# EAGLE design temperature-shift-r1 (EAGLE 6.5.0)
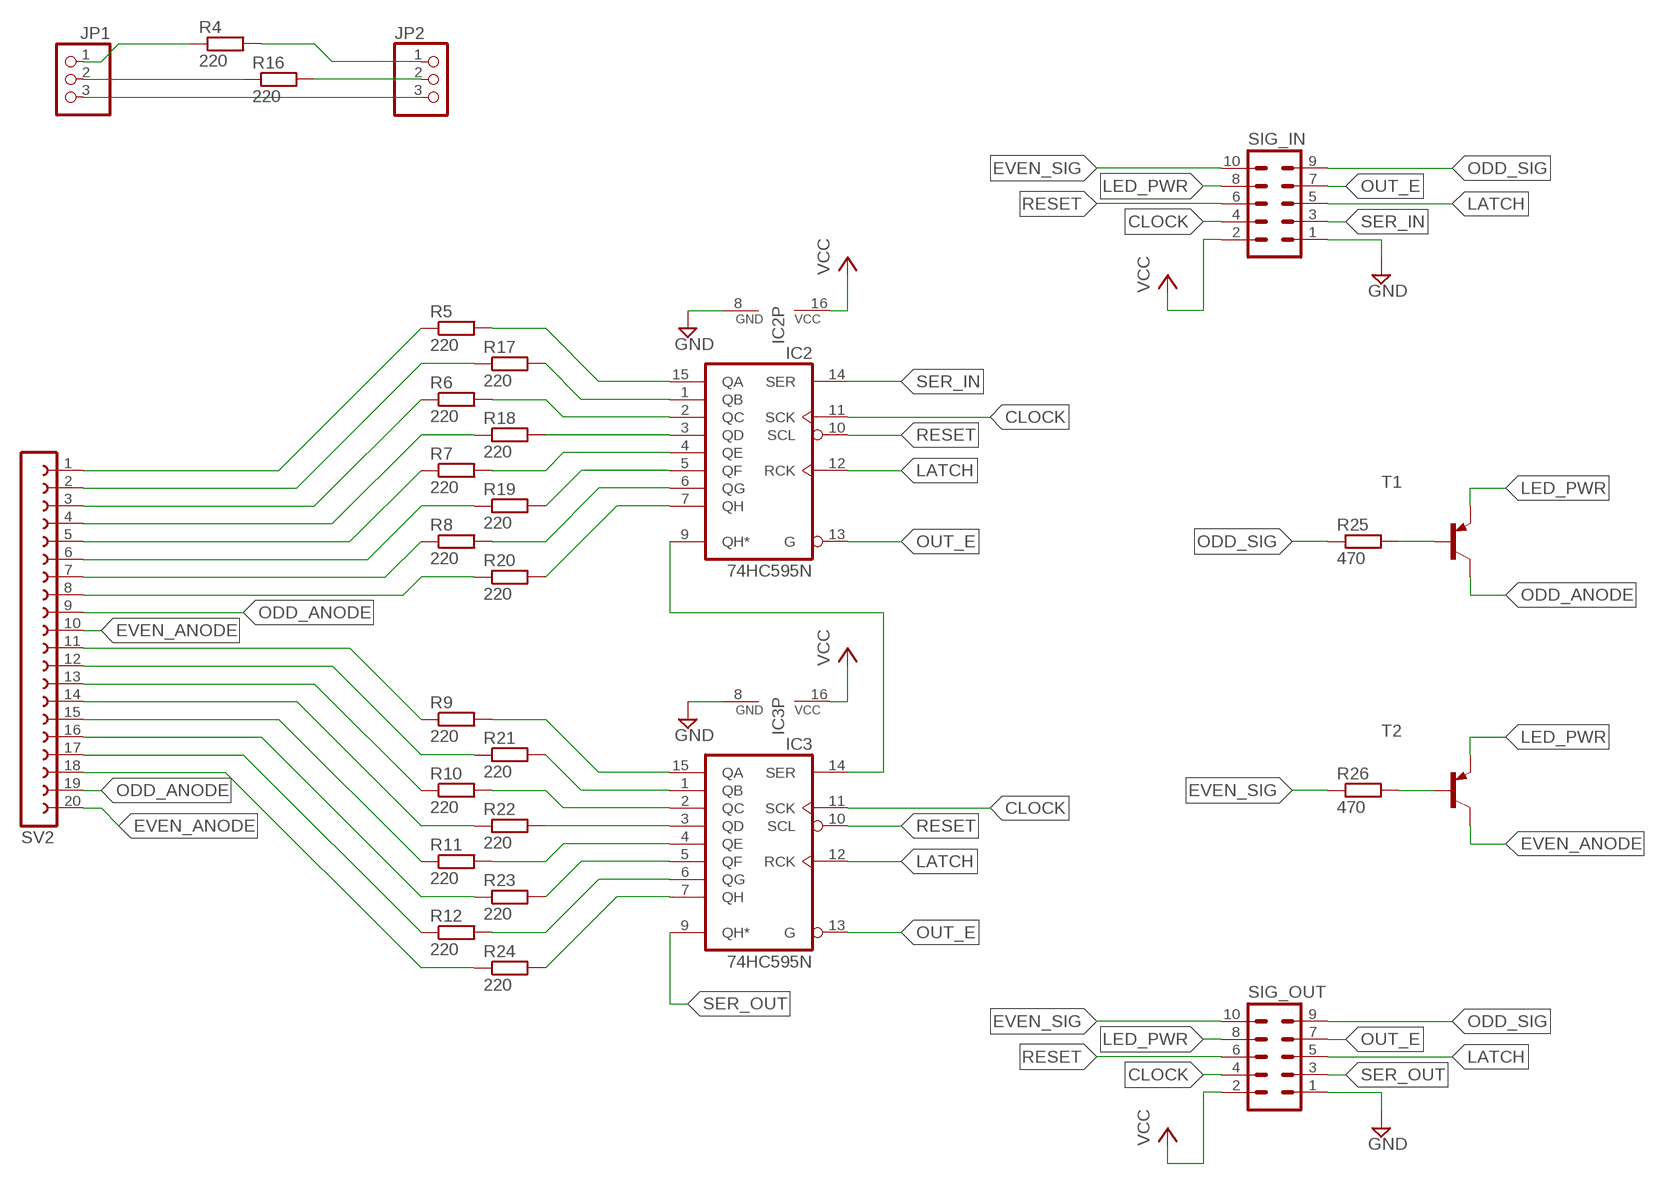
[diagram p0: schematic, sheet 1]

## Parts
IC2  74HC595N  [DIL16]
IC3  74HC595N  [DIL16]
JP1  PINHD-1X3  [1X03]
JP2  PINHD-1X3  [1X03]
R4  220  R-EU_R0805  [R0805]
R5  220  R-EU_R0805  [R0805]
R6  220  R-EU_R0805  [R0805]
R7  220  R-EU_R0805  [R0805]
R8  220  R-EU_R0805  [R0805]
R9  220  R-EU_R0805  [R0805]
R10  220  R-EU_R0805  [R0805]
R11  220  R-EU_R0805  [R0805]
R12  220  R-EU_R0805  [R0805]
R16  220  R-EU_R0805  [R0805]
R17  220  R-EU_R0805  [R0805]
R18  220  R-EU_R0805  [R0805]
R19  220  R-EU_R0805  [R0805]
R20  220  R-EU_R0805  [R0805]
R21  220  R-EU_R0805  [R0805]
R22  220  R-EU_R0805  [R0805]
R23  220  R-EU_R0805  [R0805]
R24  220  R-EU_R0805  [R0805]
R25  470  R-EU_R0805  [R0805]
R26  470  R-EU_R0805  [R0805]
SIG_IN  MA05-2  [MA05-2]
SIG_OUT  MA05-2  [MA05-2]
SV2  FE20-1  [FE20]
T1  BC557B-PNP-TO92-EBC  [TO92-EBC]
T2  BC557B-PNP-TO92-EBC  [TO92-EBC]

## Nets
CLOCK: IC2.11(SCK) IC3.11(SCK) SIG_IN.4 SIG_OUT.4
EVEN_ANODE: SV2.10 SV2.20 T2.C
EVEN_SIG: R26.1 SIG_IN.10 SIG_OUT.10
GND: IC2.8(GND) IC3.8(GND) SIG_IN.1 SIG_OUT.1
LATCH: IC2.12(RCK) IC3.12(RCK) SIG_IN.5 SIG_OUT.5
LED_PWR: SIG_IN.8 SIG_OUT.8 T1.E T2.E
N$1: IC2.15(QA) R5.2
N$2: IC2.2(QC) R6.2
N$3: IC2.4(QE) R7.2
N$4: IC2.6(QG) R8.2
N$5: R20.1 SV2.8
N$6: R19.1 SV2.6
N$7: R18.1 SV2.4
N$8: R17.1 SV2.2
N$9: IC2.1(QB) R17.2
N$10: IC2.3(QD) R18.2
N$11: IC2.5(QF) R19.2
N$12: IC2.7(QH) R20.2
N$13: IC3.15(QA) R9.2
N$14: IC3.2(QC) R10.2
N$15: IC3.4(QE) R11.2
N$16: IC3.6(QG) R12.2
N$17: R24.1 SV2.18
N$18: R23.1 SV2.16
N$19: R22.1 SV2.14
N$20: R21.1 SV2.12
N$21: IC3.1(QB) R21.2
N$22: IC3.3(QD) R22.2
N$23: IC3.5(QF) R23.2
N$24: IC3.7(QH) R24.2
N$25: IC2.9(QH*) IC3.14(SER)
N$26: R5.1 SV2.1
N$27: R6.1 SV2.3
N$28: R7.1 SV2.5
N$29: R8.1 SV2.7
N$30: R9.1 SV2.11
N$31: R10.1 SV2.13
N$32: R11.1 SV2.15
N$33: R12.1 SV2.17
N$36: JP1.2 R16.1
N$37: JP1.1 R4.1
N$39: JP2.1 R4.2
N$42: JP1.3 JP2.3
N$44: JP2.2 R16.2
N$53: R26.2 T2.B
N$54: R25.2 T1.B
ODD_ANODE: SV2.9 SV2.19 T1.C
ODD_SIG: R25.1 SIG_IN.9 SIG_OUT.9
OUT_E: IC2.13(G) IC3.13(G) SIG_IN.7 SIG_OUT.7
RESET: IC2.10(SCL) IC3.10(SCL) SIG_IN.6 SIG_OUT.6
SER_IN: IC2.14(SER) SIG_IN.3
SER_OUT: IC3.9(QH*) SIG_OUT.3
VCC: IC2.16(VCC) IC3.16(VCC) SIG_IN.2 SIG_OUT.2

## Library data of the parts
IC2 IC3 = 74xx-eu:74*595: 8-bit SHIFT REGISTER, output latch
JP1 JP2 = pinhead:PINHD-1X3: PIN HEADER
R4-R12 R16-R26 = rcl:R-EU_: RESISTOR, European symbol
SIG_IN SIG_OUT = con-lstb:MA05-2: PIN HEADER; OC_FARNELL: unknown; OC_NEWARK: unknown
SV2 = con-lsta:FE20-1: FEMALE HEADER; OC_FARNELL: unknown; OC_NEWARK: unknown
T1 T2 = transistor:*-PNP-: PNP Transistror

## Board
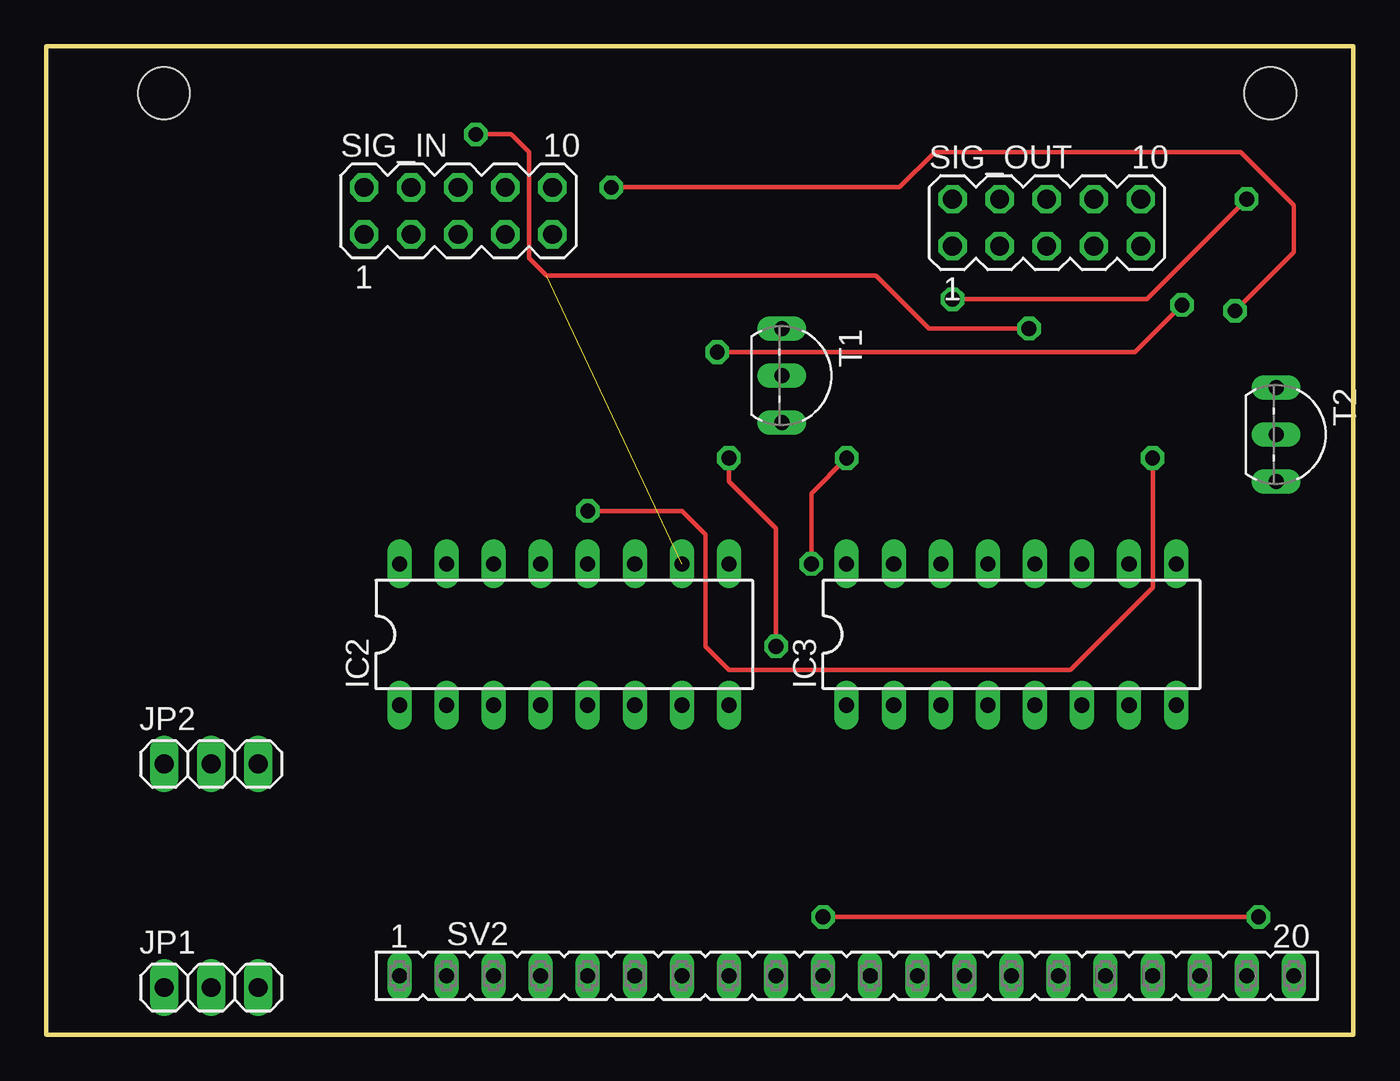
[diagram p1: board, top side]
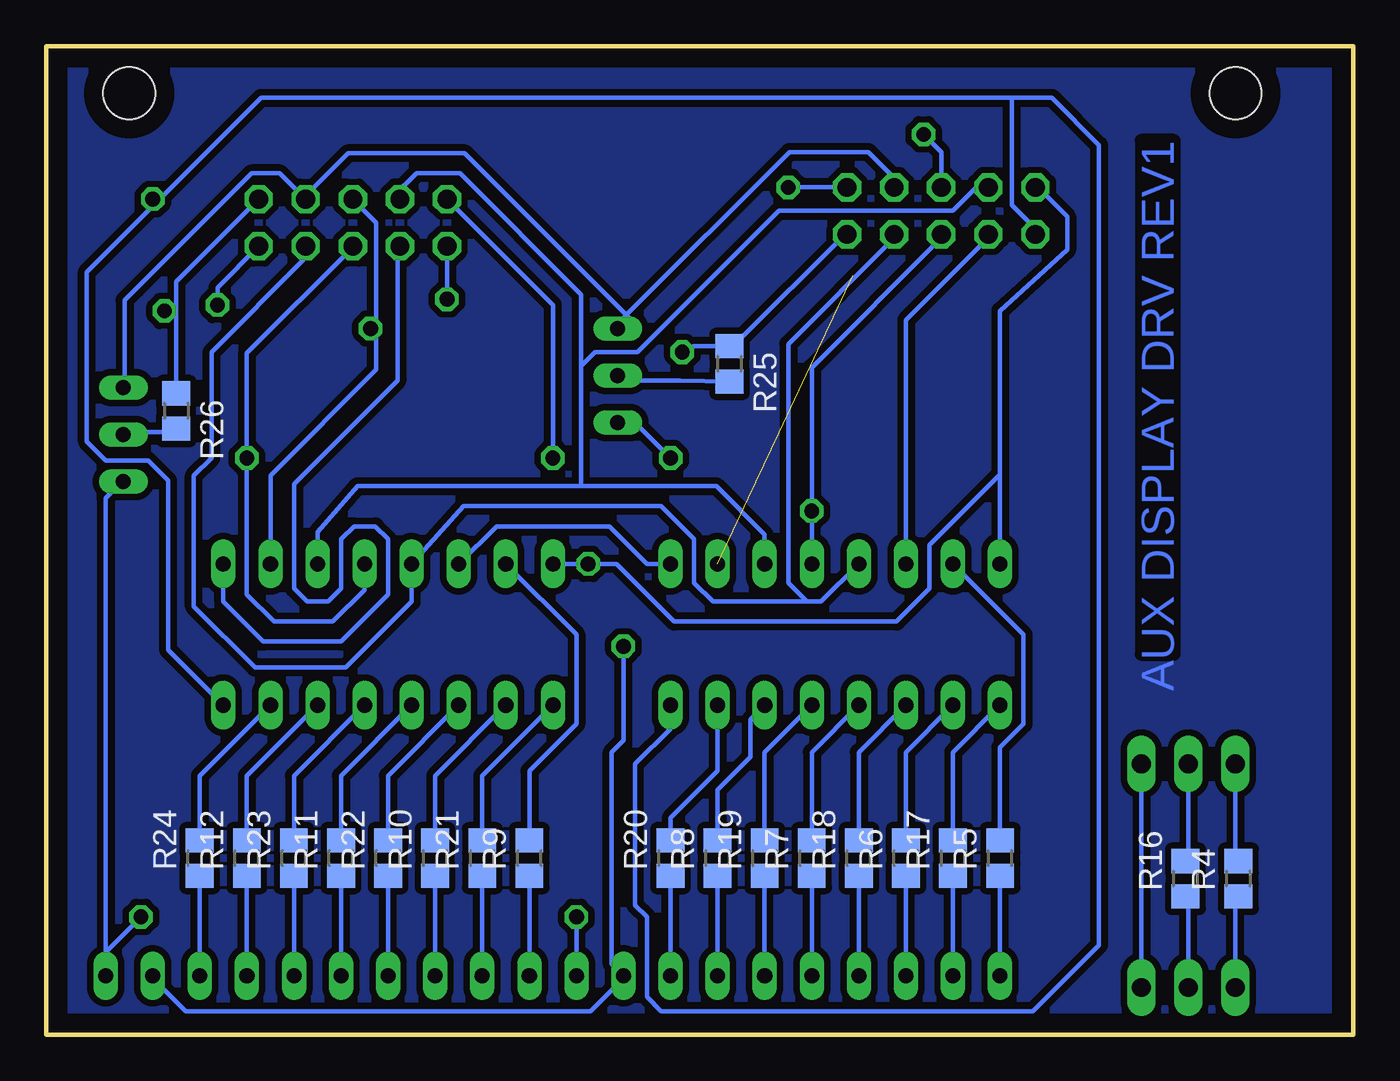
[diagram p2: board, bottom side, seen from below]

Size 70.51 x 53.33 mm. Coordinates in mm from the lower left corner, seen from the top.
Outline: 0,0 70.51,0 70.51,53.33 0,53.33 0,0
Copper layers (1*16): Top 0.035mm / dielectric 1.5mm / Bottom 0.035mm
Design rules "default *": minimum track width 10mil, minimum drill 24mil, track to track 14mil, track to pad 14mil, pad to pad 14mil, via to via 14mil, smd to smd 14mil, copper to edge 40mil, drill to drill 8mil, minimum pad ring 10mil, minimum via ring 8mil, stop-mask expansion 4mil, vias tented up to drill 0mil, thermal gap 10mil
Holes 2.8 mm at 6.35,50.8 66.04,50.8

### Footprints (pad centres in the part's own frame; a part is rotated, then mirrored left to right if it is on the bottom)
DIL16 = drill 0.813 long: 1 -8.89,-3.81; 2 -6.35,-3.81; 3 -3.81,-3.81; 4 -1.27,-3.81; 5 1.27,-3.81; 6 3.81,-3.81; 7 6.35,-3.81; 8 8.89,-3.81; 9 8.89,3.81; 10 6.35,3.81; 11 3.81,3.81; 12 1.27,3.81; 13 -1.27,3.81; 14 -3.81,3.81; 15 -6.35,3.81; 16 -8.89,3.81
1X03 = drill 1.016 long: 1 -2.54,0; 2 0,0; 3 2.54,0
R0805 = smd 1.3 x 1.5: 1 -0.95,0; 2 0.95,0
MA05-2 = drill 1.016 octagon: 1 -5.08,-1.27; 2 -5.08,1.27; 3 -2.54,-1.27; 4 -2.54,1.27; 5 0,-1.27; 6 0,1.27; 7 2.54,-1.27; 8 2.54,1.27; 9 5.08,-1.27; 10 5.08,1.27
FE20 = drill 0.813 long: 1 -24.13,0; 2 -21.59,0; 3 -19.05,0; 4 -16.51,0; 5 -13.97,0; 6 -11.43,0; 7 -8.89,0; 8 -6.35,0; 9 -3.81,0; 10 -1.27,0; 11 1.27,0; 12 3.81,0; 13 6.35,0; 14 8.89,0; 15 11.43,0; 16 13.97,0; 17 16.51,0; 18 19.05,0; 19 21.59,0; 20 24.13,0
TO92-EBC = drill 0.813 long: B 0,-1.27; C 2.54,-1.27; E -2.54,-1.27

### Placement (x,y rotation side)
IC2  27.94,21.59 0 top
IC3  52.07,21.59 0 top
JP1  8.89,2.54 0 top
JP2  8.89,14.61 0 top
R4  6.19,8.41 90 bottom
R5  19.05,9.53 90 bottom
R6  24.13,9.53 90 bottom
R7  29.21,9.53 90 bottom
R8  34.29,9.53 90 bottom
R9  44.45,9.53 90 bottom
R10  49.53,9.53 90 bottom
R11  54.61,9.53 90 bottom
R12  59.69,9.53 90 bottom
R16  9.05,8.41 90 bottom
R17  21.59,9.53 90 bottom
R18  26.67,9.53 90 bottom
R19  31.75,9.53 90 bottom
R20  36.83,9.53 90 bottom
R21  46.99,9.53 90 bottom
R22  52.07,9.53 90 bottom
R23  57.15,9.53 90 bottom
R24  62.23,9.53 90 bottom
R25  33.66,36.2 270 bottom
R26  63.5,33.66 270 bottom
SIG_IN  22.23,44.45 0 top
SIG_OUT  53.98,43.81 0 top
SV2  43.18,3.17 0 top
T1  40.96,35.56 270 top
T2  67.63,32.38 270 top

### Tracks (layer width: path | path; a pad name or v marks a point on that pad's centre or on a via)
CLOCK
  Bottom 0.254: IC2.11 31.75,26.99 34.35,29.59 41.66,29.59 | 41.66,29.59 53.72,29.59 55.88,27.11 IC3.11 | SIG_IN.4 20.32,45.72 21.59,44.45 30.99,44.45 38.61,36.83 40.89,36.83 41.66,36.07 | 41.66,29.59 41.66,36.07 | 41.66,36.07 41.66,39.94 48.2,46.48 50.55,46.48 51.82,45.21 51.31,45.21 SIG_OUT.4
EVEN_ANODE  (via drill 0.8 pad 1.27)
  Top 0.254: v41.91,6.35 v65.41,6.35
  Bottom 0.254: 67.31,4.45 67.31,28.96 66.55,29.72 T2.C | SV2.10 v41.91,6.35 | v65.41,6.35 67.31,4.45 | 67.31,4.45 SV2.20
EVEN_SIG  (via drill 0.8 pad 1.27)
  Top 0.254: v30.48,45.72 46.04,45.72 47.94,47.62 64.45,47.62 67.31,44.77 67.31,42.23 v64.14,39.05
  Bottom 0.254: 63.5,39.05 63.5,40.64 SIG_OUT.10 | 63.5,39.05 R26.1 | SIG_IN.10 v30.48,45.72 | v64.14,39.05 63.5,39.05
GND  (via drill 0.8 pad 1.27)
  Top 0.254: v48.9,39.69 59.37,39.69 v64.77,45.09
  Bottom 0.254: IC2.8 36.83,16.51 38.73,14.61 38.73,6.99 38.1,6.35 38.1,2.03 37.34,1.27 17.27,1.27 13.72,4.83 13.72,48.01 16.26,50.55 18.41,50.55 | 18.41,50.55 58.93,50.55 64.58,44.9 | 64.58,44.9 68.33,41.15 68.33,32 67.31,30.99 65.02,30.99 63.94,29.91 63.94,20.77 IC3.8 | SIG_OUT.1 v48.9,39.69 | v64.77,45.09 64.58,44.9 | SIG_IN.1 17.14,43.5 18.41,44.77 18.41,50.55
LATCH  (via drill 0.8 pad 1.27)
  Top 0.254: v29.21,28.26 34.29,28.26 35.56,26.99 35.56,20.95 36.83,19.68 55.24,19.68 59.69,24.13 v59.69,31.11
  Bottom 0.254: SIG_IN.5 22.35,42.86 29.21,36.01 v29.21,28.26 IC2.12 | IC3.12 53.34,24 55.05,22.29 58.23,22.29 59.69,23.75 v59.69,31.11 | v59.69,31.11 59.69,36.77 54.1,42.35 54.1,42.42 SIG_OUT.5 | v59.69,31.11 59.69,30.8
LED_PWR
  Bottom 0.254: T2.E 66.29,35.05 66.29,39.62 59.44,46.48 57.91,46.48 SIG_OUT.8 56.39,45.21 56.58,45.21 54.23,47.56 47.94,47.56 38.48,38.1 | 38.48,38.1 39.31,38.73 30.42,47.62 26.16,47.62 24.89,46.35 SIG_IN.8 | 38.48,38.1 T1.E 39.62,38.1
N$1
  Bottom 0.254: R5.2 19.05,15.49 17.78,16.76 17.78,21.59 IC2.15
N$2
  Bottom 0.254: R6.2 24.13,15.24 IC2.2
N$3
  Bottom 0.254: R7.2 29.21,15.24 IC2.4
N$4
  Bottom 0.254: R8.2 34.29,13.21 32.51,14.99 32.51,17.02 IC2.6
N$5
  Bottom 0.254: SV2.8 R20.1
N$6
  Bottom 0.254: SV2.6 R19.1
N$7
  Bottom 0.254: SV2.4 R18.1
N$8
  Bottom 0.254: SV2.2 R17.1
N$9
  Bottom 0.254: R17.2 21.59,15.24 IC2.1
N$10
  Bottom 0.254: R18.2 26.67,15.24 IC2.3
N$11
  Bottom 0.254: R19.2 31.75,15.24 IC2.5
N$12
  Bottom 0.254: R20.2 36.83,11.68 34.29,14.22 IC2.7
N$13
  Bottom 0.254: R9.2 44.45,14.22 41.91,16.76 41.91,21.59 IC3.15
N$14
  Bottom 0.254: R10.2 49.53,13.97 IC3.2
N$15
  Bottom 0.254: R11.2 54.61,13.97 IC3.4
N$16
  Bottom 0.254: R12.2 59.69,13.97 IC3.6
N$17
  Bottom 0.254: SV2.18 R24.1
N$18
  Bottom 0.254: SV2.16 R23.1
N$19
  Bottom 0.254: SV2.14 R22.1
N$20
  Bottom 0.254: SV2.12 R21.1
N$21
  Bottom 0.254: R21.2 46.99,13.97 IC3.1
N$22
  Bottom 0.254: R22.2 52.07,13.97 IC3.3
N$23
  Bottom 0.254: R23.2 57.15,13.97 IC3.5
N$24
  Bottom 0.254: R24.2 62.23,13.97 IC3.7
N$25
  Bottom 0.254: IC2.9 38.1,25.4 40.13,27.43 46.23,27.43 IC3.14
N$26
  Bottom 0.254: SV2.1 R5.1
N$27
  Bottom 0.254: SV2.3 R6.1
N$28
  Bottom 0.254: SV2.5 R7.1
N$29
  Bottom 0.254: SV2.7 R8.1
N$30
  Bottom 0.254: SV2.11 R9.1
N$31
  Bottom 0.254: SV2.13 R10.1
N$32
  Bottom 0.254: SV2.15 R11.1
N$33
  Bottom 0.254: SV2.17 R12.1
N$34
  pour Bottom: -0.64,53.34 70.48,53.34 70.48,-0.64 -0.64,-0.64
N$36
  Bottom 0.254: JP1.2 8.89,7.37 R16.1
N$37
  Bottom 0.254: JP1.1 6.35,7.37 R4.1
N$39
  Bottom 0.254: JP2.1 6.35,9.4 R4.2
N$42
  Bottom 0.254: JP2.3 JP1.3
N$44
  Bottom 0.254: JP2.2 8.89,9.4 R16.2
N$53
  Bottom 0.254: R26.2 63.5,32.51 66.29,32.51 T2.B
N$54
  Bottom 0.254: R25.2 36.32,35.31 39.37,35.31 39.62,35.56 T1.B
ODD_ANODE  (via drill 0.8 pad 1.27)
  Top 0.254: v39.37,20.95 39.37,27.3 36.83,29.84 v36.83,31.11
  Bottom 0.254: SV2.19 64.77,3.05 62.99,1.27 41.15,1.27 39.37,3.05 SV2.9 40.01,3.81 40.01,15.24 39.37,15.88 v39.37,20.95 | v36.83,31.11 38.73,33.02 T1.C
ODD_SIG  (via drill 0.8 pad 1.27)
  Top 0.254: v36.2,36.83 58.74,36.83 v61.28,39.37
  Bottom 0.254: SIG_IN.9 27.43,43.18 33.27,37.34 33.53,37.66 R25.1 35.56,37.15 v36.2,36.83 | v61.28,39.37 61.28,40.32 SIG_OUT.9
OUT_E
  Bottom 0.254: IC2.13 28.7,23.37 29.46,23.37 | 29.46,23.37 30.48,24.38 30.48,37.27 24.89,42.86 SIG_IN.7 | 29.46,23.37 34.54,23.37 35.56,24.38 35.56,26.73 37.34,28.51 48.01,28.51 IC3.13 50.8,23.37 54.36,19.81 59.24,19.81 62.55,23.11 62.55,30.16 61.59,31.11 61.59,36.83 56.64,41.78 56.64,42.42 SIG_OUT.7
RESET  (via drill 0.8 pad 1.27)  (1 unrouted)
  Top 0.254: v23.18,48.58 25.08,48.58 26.04,47.62 26.04,41.91 26.99,40.96 44.77,40.96 47.62,38.1 v53.02,38.1
  Bottom 0.254: IC3.10 58.42,30.16 52.7,35.88 52.7,38.42 | 52.7,38.42 52.7,43.81 SIG_OUT.6 | SIG_IN.6 22.23,47.62 v23.18,48.58 | v53.02,38.1 52.7,38.42
SER_IN
  Bottom 0.254: IC2.14 24.13,38.54 19.81,42.86 SIG_IN.3
SER_OUT
  Bottom 0.254: IC3.9 60.96,23.37 58.8,21.21 54.61,21.21 52.07,23.75 52.07,26.73 52.77,27.43 53.91,27.43 54.61,26.73 54.61,24.07 55.31,23.37 56.45,23.37 57.15,24.07 57.15,29.72 51.56,35.31 51.56,42.42 SIG_OUT.3
VCC  (via drill 0.8 pad 1.27)
  Top 0.254: v41.27,25.4 41.27,29.21 v43.18,31.11
  Bottom 0.254: 19.05,30.23 19.05,39.05 15.43,42.35 15.43,44.13 17.02,45.72 SIG_IN.2 | 19.05,30.23 IC2.16 | 19.05,30.23 22.86,26.42 22.86,24.07 24.64,22.29 36.64,22.29 39.75,25.4 v41.27,25.4 IC3.16 | v43.18,31.11 43.18,39.37 SIG_OUT.2

### Text on the board
Bottom: AUX DISPLAY DRV REV1